# EAGLE design mjGSM (EAGLE 8.4.0)
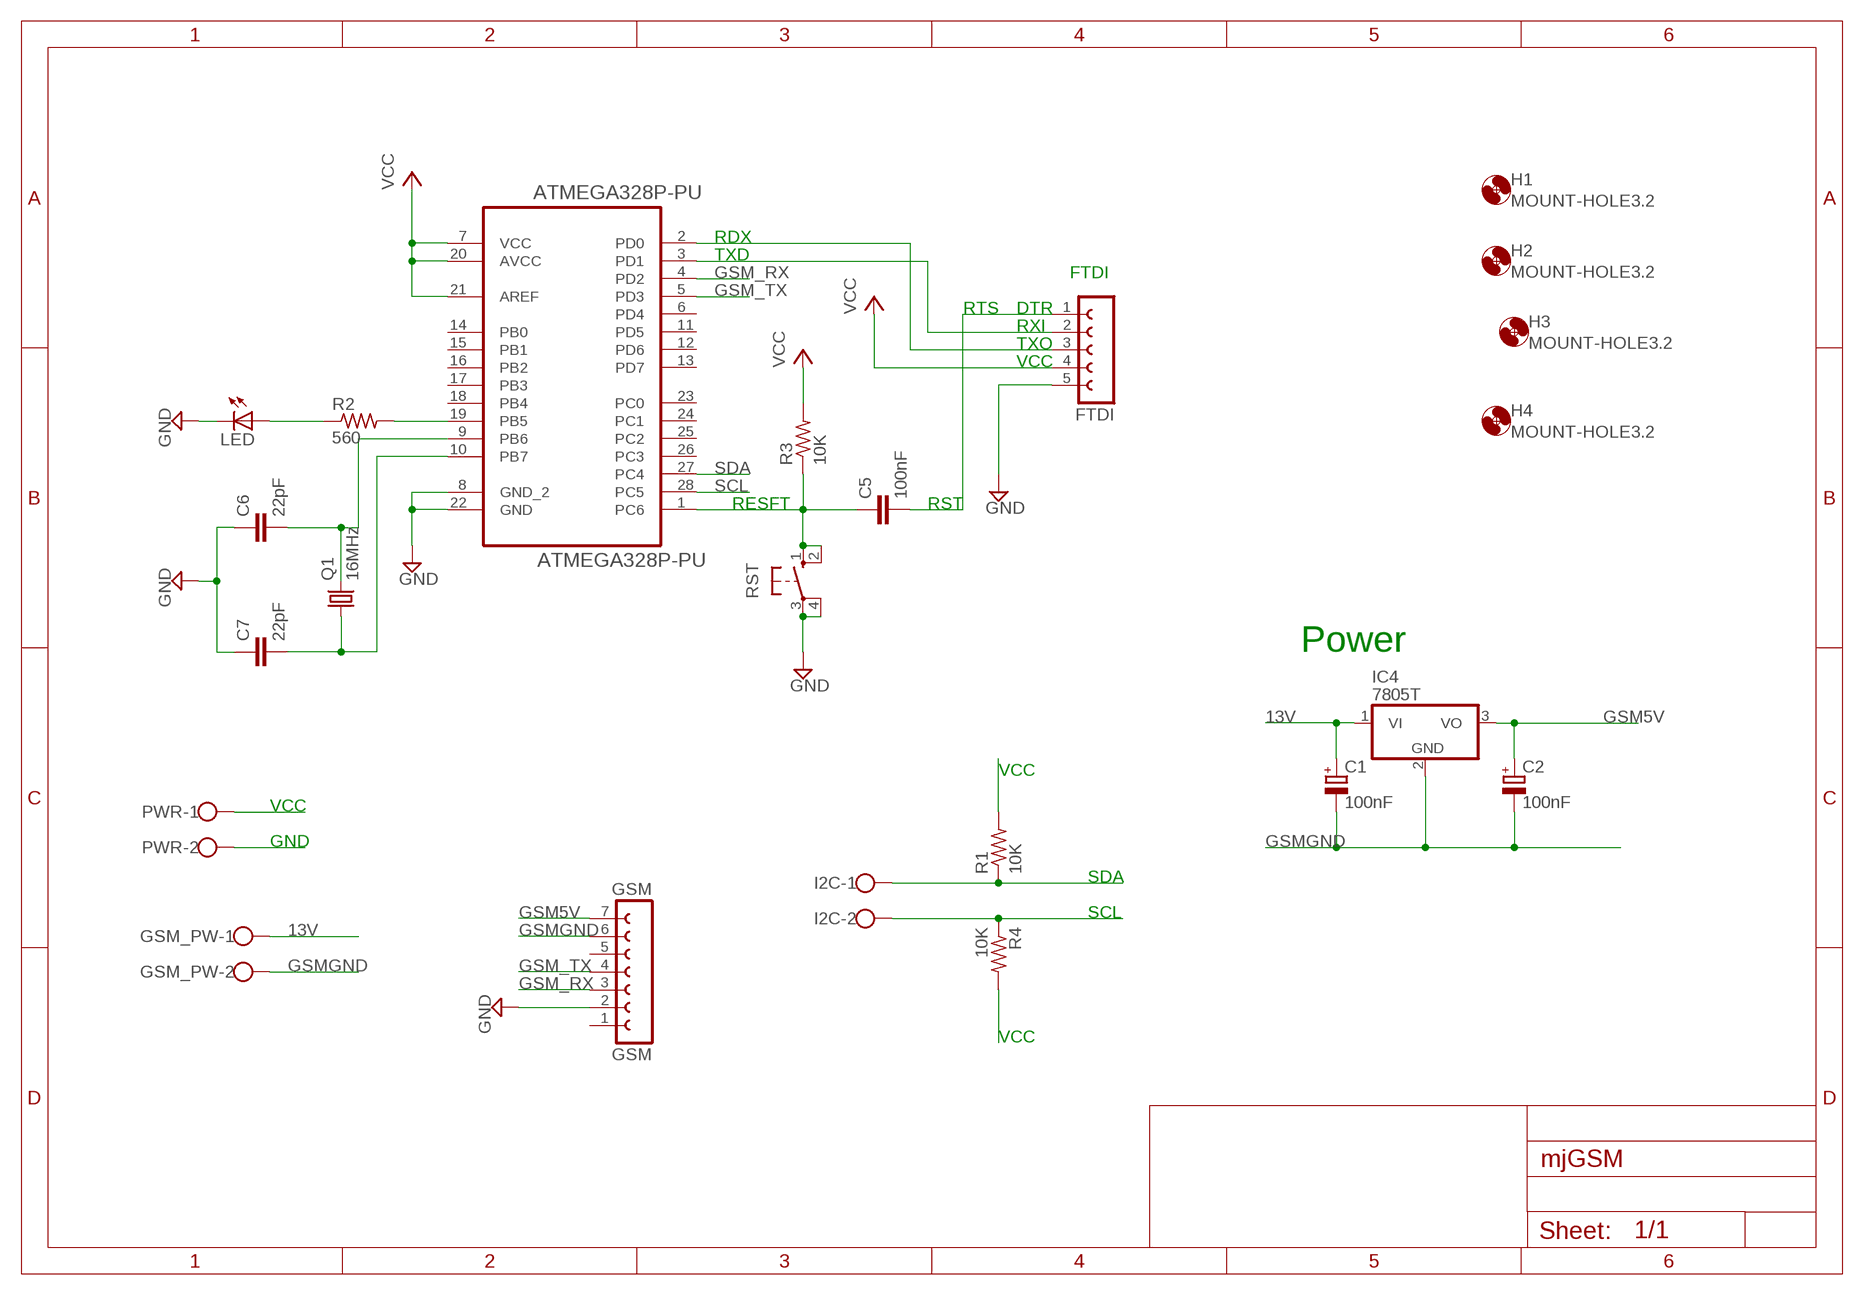
[diagram p0: schematic, sheet 1]

## Parts
ATMEGA328P-PU  ATMEGA328P-PU  [DIP254P762X457-28]
C1  100nF  CPOL-EUE2-4  [E2-4]
C2  100nF  CPOL-EUE2-4  [E2-4]
C5  100nF  C-EU025-024X044  [C025-024X044]
C6  22pF  C-EU025-024X044  [C025-024X044]
C7  22pF  C-EU025-024X044  [C025-024X044]
FTDI  FE05-1  [FE05-1]
GSM  GSM  FE07-1  [FE07]
GSM_PW  W237-102  [W237-102]
H1  MOUNT-HOLE3.2  [3,2]
H2  MOUNT-HOLE3.2  [3,2]
H3  MOUNT-HOLE3.2  [3,2]
H4  MOUNT-HOLE3.2  [3,2]
I2C  W237-102  [W237-102]
IC4  7805T  [TO220H]
LED  LED3MM  [LED3MM]
PWR  W237-102  [W237-102]
Q1  16MHz  CRYSTALHC49S  [HC49/S]
R1  10K  R-US_0204/5  [0204/5]
R2  560  R-US_0204/5  [0204/5]
R3  10K  R-US_0204/5  [0204/5]
R4  10K  R-US_0204/5  [0204/5]
RST  10-XX  [B3F-10XX]

## Nets
13V: C1.+ GSM_PW.1 IC4.1(VI)
GND: ATMEGA328P-PU.8(GND_2) ATMEGA328P-PU.22(GND) C6.1 C7.1 FTDI.5 GSM.2 LED.K(C) PWR.2 RST.3(P) RST.4(P1)
GSM5V: C2.+ GSM.7 IC4.3(VO)
GSM_RX: ATMEGA328P-PU.4(PD2) GSM.3
GSM_TX: ATMEGA328P-PU.5(PD3) GSM.4
GSMGND: C1.- C2.- GSM.6 GSM_PW.2 IC4.2(GND)
N$1: LED.A R2.1
N$2: ATMEGA328P-PU.19(PB5) R2.2
N$3: ATMEGA328P-PU.2(PD0) FTDI.3
N$4: ATMEGA328P-PU.3(PD1) FTDI.2
N$5: ATMEGA328P-PU.1(PC6) C5.1 R3.1 RST.1(S) RST.2(S1)
N$6: ATMEGA328P-PU.9(PB6) C6.2 Q1.2
N$7: C5.2 FTDI.1
N$8: ATMEGA328P-PU.10(PB7) C7.2 Q1.1
SCL: ATMEGA328P-PU.28(PC5) I2C.2 R4.1
SDA: ATMEGA328P-PU.27(PC4) I2C.1 R1.1
VCC: ATMEGA328P-PU.7(VCC) ATMEGA328P-PU.20(AVCC) ATMEGA328P-PU.21(AREF) FTDI.4 PWR.1 R1.2 R3.2 R4.2
Unconnected: ATMEGA328P-PU.6(PD4) ATMEGA328P-PU.11(PD5) ATMEGA328P-PU.12(PD6) ATMEGA328P-PU.13(PD7) ATMEGA328P-PU.14(PB0) ATMEGA328P-PU.15(PB1) ATMEGA328P-PU.16(PB2) ATMEGA328P-PU.17(PB3) ATMEGA328P-PU.18(PB4) ATMEGA328P-PU.23(PC0) ATMEGA328P-PU.24(PC1) ATMEGA328P-PU.25(PC2) ATMEGA328P-PU.26(PC3) GSM.1 GSM.5

## Notes on the sheet
- RDX
- TXD
- FTDI
- RTS | DTR
- RXI
- TXO
- VCC
- RESFT | RST
- Power
- VCC
- VCC
- GND
- SDA
- SCL
- VCC

## Library data of the parts
ATMEGA328P-PU = Atmel_By_element14_Batch_1-00:ATMEGA328P-PU: 8-bit Microcontroller with In-System Programmable Flash; MPN: ATMEGA328P-PU; OC_FARNELL: 1715487; OC_NEWARK: 15R0268; PACKAGE: PDIP-28; SUPPLIER: Atmel
C1 C2 = rcl:CPOL-EU: POLARIZED CAPACITOR, European symbol
C5-C7 = my_rcl:C-EU: CAPACITOR, European symbol
FTDI = con-lsta:FE05-1: FEMALE HEADER; OC_FARNELL: unknown; OC_NEWARK: unknown
GSM = con-lsta:FE07-1: FEMALE HEADER; OC_FARNELL: unknown; OC_NEWARK: unknown
GSM_PW I2C = con-wago-500:W237-102: WAGO SCREW CLAMP; MPN: 237-102; OC_FARNELL: unknown; OC_NEWARK: 70K9898
H1-H4 = holes:MOUNT-HOLE: MOUNTING HOLE with drill center marker
IC4 = linear:78*: Positive VOLTAGE REGULATOR Source: http://cache.national.com/ds/LM/LM78L05.pdf http://www.fairchildsemi.com/ds/LM/LM7805.pdf
LED = led:LED: LED OSRAM: - CHIPLED LG R971, LG N971, LY N971, LG Q971, LY Q971, LO R971, LY R971 LH N974, LH R974 LS Q976, LO Q976, LY Q976 LO Q996 - Hyper CHIPLED LW Q18S LB Q993, LB Q99A, LB R99A - SideLED LS A670, LO A670, LY A670, LG A670, LP A670 LB A673, LV A673, LT A673, LW A673 LH A674 LY A675 LS A676, LA A676, LO A676, LY A676, LW A676 LS A679, LY A679, LG A679 - Hyper Micro SIDELED® LS Y876, LA Y876, LO Y876, LY Y876 LT Y87S - SmartLED LW L88C, LW L88S LB L89C, LB L89S, LG L890 LS L89K, LO L89K, LY L89K LS L896, LA L896, LO L896, LY L896 - TOPLED LS T670, LO T670, LY T670, LG T670, LP T670 LSG T670, LSP T670, LSY T670, LOP T670, LYG T670 LG T671, LOG T671, LSG T671 LB T673, LV T673, LT T673, LW T673 LH T674 LS T676, LA T676, LO T676, LY T676, LB T676, LH T676, LSB T676, LW T676 LB T67C, LV T67C, LT T67C, LS T67K, LO T67K, LY T67K, LW E67C LS E67B, LA E67B, LO E67B, LY E67B, LB E67C, LV E67C, LT E67C LW T67C LS T679, LY T679, LG T679 LS T770, LO T770, LY T770, LG T770, LP T770 LB T773, LV T773, LT T773, LW T773 LH T774 LS E675, LA E675, LY E675, LS T675 LS T776, LA T776, LO T776, LY T776, LB T776 LHGB T686 LT T68C, LB T68C - Hyper Mini TOPLED® LB M676 - Mini TOPLED Santana® LG M470 LS M47K, LO M47K, LY M47K Source: http://www.osram.convergy.de LUXEON: - LUMILED® LXK2-PW12-R00, LXK2-PW12-S00, LXK2-PW14-U00, LXK2-PW14-V00 LXK2-PM12-R00, LXK2-PM12-S00, LXK2-PM14-U00 LXK2-PE12-Q00, LXK2-PE12-R00, LXK2-PE12-S00, LXK2-PE14-T00, LXK2-PE14-U00 LXK2-PB12-K00, LXK2-PB12-L00, LXK2-PB12-M00, LXK2-PB14-N00, LXK2-PB14-P00, LXK2-PB14-Q00 LXK2-PR12-L00, LXK2-PR12-M00, LXK2-PR14-Q00, LXK2-PR14-R00 LXK2-PD12-Q00, LXK2-PD12-R00, LXK2-PD12-S00 LXK2-PH12-R00, LXK2-PH12-S00 LXK2-PL12-P00, LXK2-PL12-Q00, LXK2-PL12-R00 Source: www.luxeon.com KINGBRIGHT: KA-3528ASYC Source: www.kingbright.com
PWR = con-wago-500:W237-102: WAGO SCREW CLAMP; MPN: 237-102; OC_FARNELL: unknown; OC_NEWARK: 70K9898; SPICEPREFIX: X
Q1 = crystal:CRYSTAL: CRYSTAL; OC_FARNELL: 1667008; OC_NEWARK: unknown
R1-R4 = my_rcl:R-US_: RESISTOR, American symbol
RST = switch-omron:10-XX: OMRON SWITCH; MPN: B3F-1000; OC_FARNELL: 176432; OC_NEWARK: 36M3542

## Board
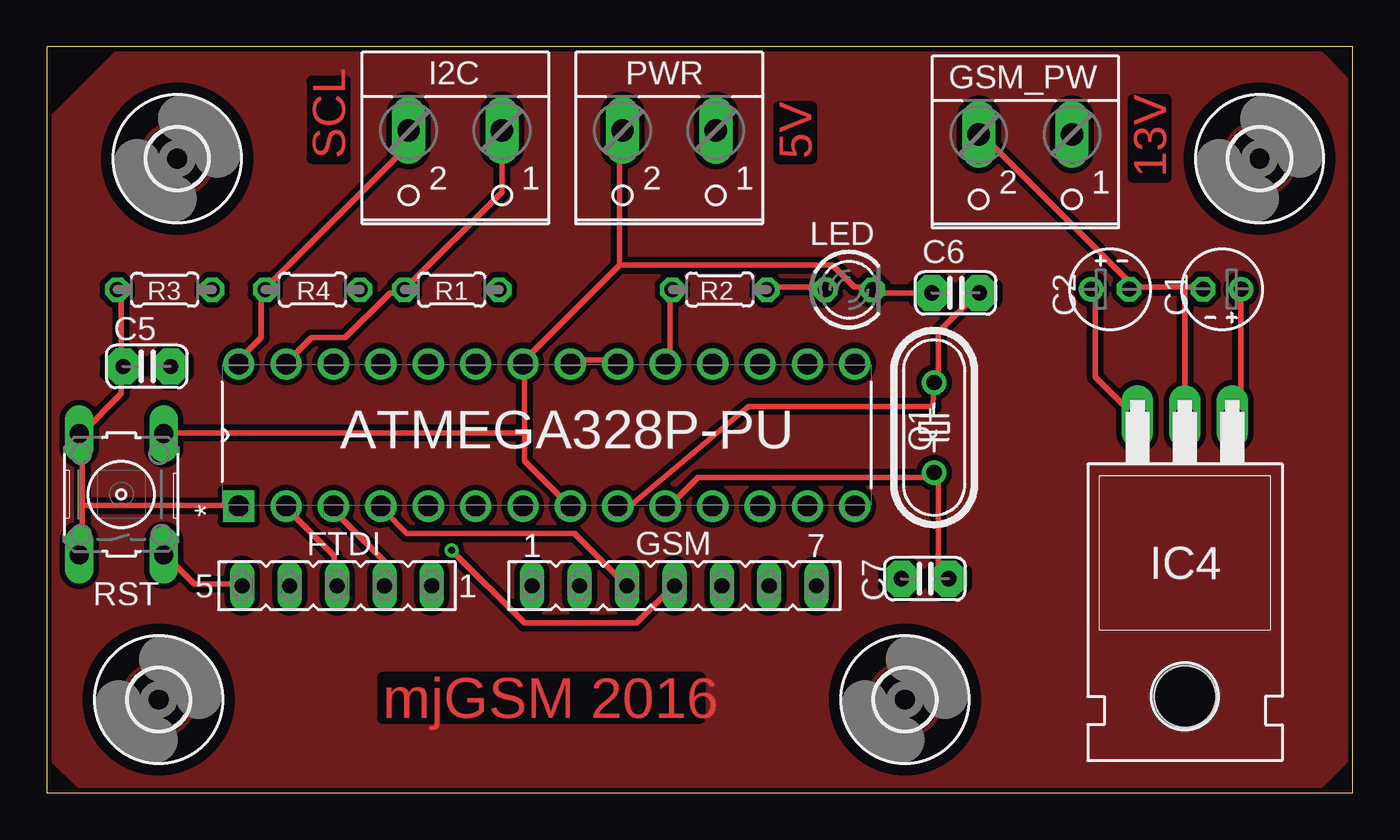
[diagram p1: board, top side]
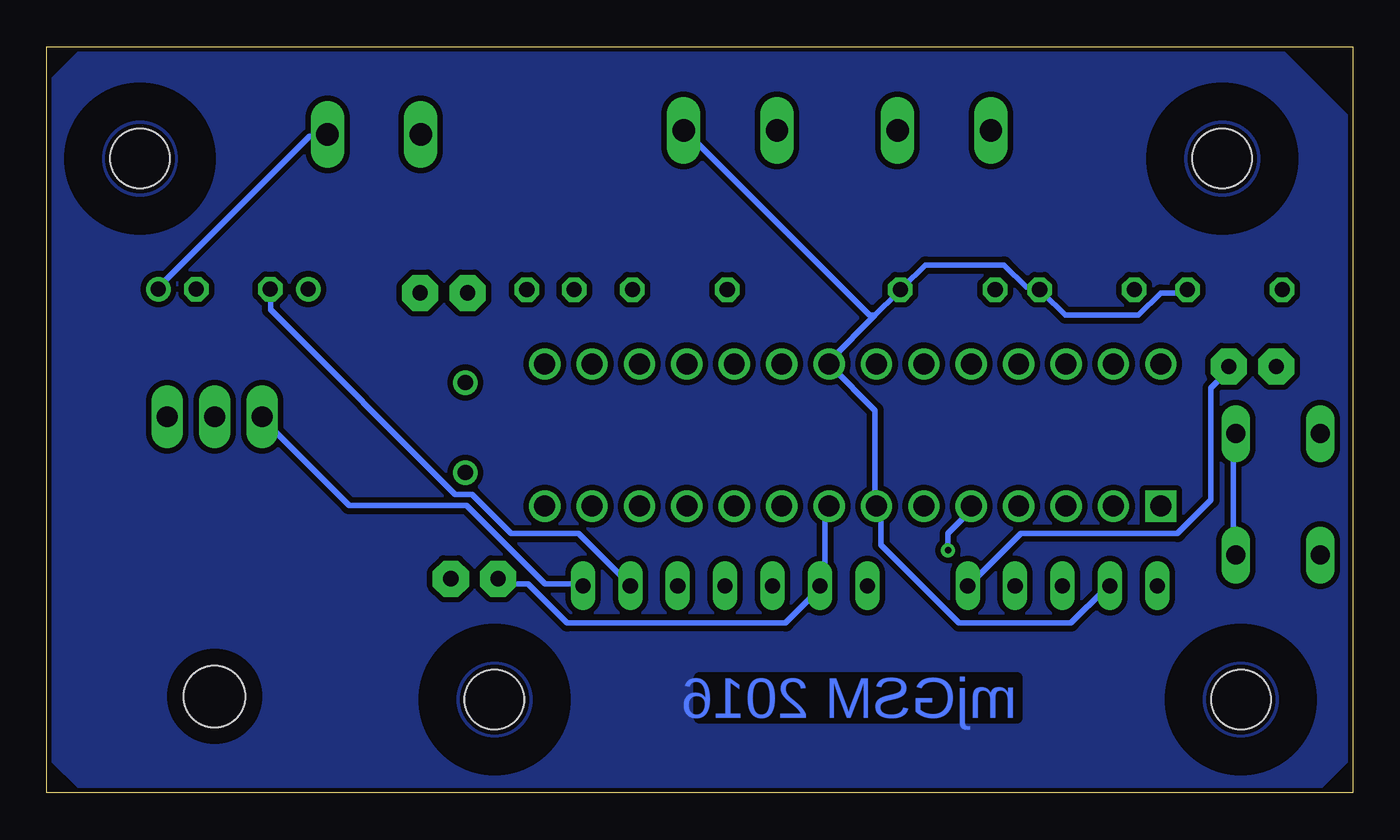
[diagram p2: board, bottom side, seen from below]

Size 70 x 40 mm. Coordinates in mm from the lower left corner, seen from the top.
Outline: 0,0 70,0 70,40 0,40 0,0
Copper layers (1*16): Top 0.105mm / dielectric 1.55mm / Bottom 0.105mm
Design rules "eC_2Layer_PClass3_BaseCopperO105 *": minimum track width 0.3mm, minimum drill 0.35mm, track to track 0.3mm, track to pad 0.3mm, pad to pad 0.3mm, via to via 0.3mm, smd to smd 0mil, copper to edge 0.25mm, drill to drill 0.35mm, minimum pad ring 0.25mm, minimum via ring 0.2mm, stop-mask expansion 0mil, vias tented up to drill 0.45mm, thermal gap 0.2mm

### Footprints (pad centres in the part's own frame; a part is rotated, then mirrored left to right if it is on the bottom)
DIP254P762X457-28 = drill 1.118 square: 1 -7.62,33.02 | drill 1.118: 2 -7.62,30.48; 3 -7.62,27.94; 4 -7.62,25.4; 5 -7.62,22.86; 6 -7.62,20.32; 7 -7.62,17.78; 8 -7.62,15.24; 9 -7.62,12.7; 10 -7.62,10.16; 11 -7.62,7.62; 12 -7.62,5.08; 13 -7.62,2.54; 14 -7.62,0; 15 0,0; 16 0,2.54; 17 0,5.08; 18 0,7.62; 19 0,10.16; 20 0,12.7; 21 0,15.24; 22 0,17.78; 23 0,20.32; 24 0,22.86; 25 0,25.4; 26 0,27.94; 27 0,30.48; 28 0,33.02
E2-4 = drill 0.813 pad 1.27: + -1.016,0 | drill 0.813 pad 1.27 octagon: - 1.016,0
C025-024X044 = drill 0.813 pad 1.93 octagon: 1 -1.27,0; 2 1.27,0
FE05-1 = drill 0.813 long: 1 -5.08,0; 2 -2.54,0; 3 0,0; 4 2.54,0; 5 5.08,0
FE07 = drill 0.813 long: 1 -7.62,0; 2 -5.08,0; 3 -2.54,0; 4 0,0; 5 2.54,0; 6 5.08,0; 7 7.62,0
W237-102 = drill 1.194 long: 1 -2.5,-1.27; 2 2.5,-1.27
3,2 = hole 3.2: 0,0
TO220H = drill 1.118 long: 1 -2.54,-10.16; 2 0,-10.16; 3 2.54,-10.16 | hole 3.302: 0,4.826
LED3MM = drill 0.813 octagon: A -1.27,0; K 1.27,0
HC49/S = drill 0.813: 1 -2.413,0; 2 2.413,0
0204/5 = drill 0.813 octagon: 1 -2.54,0; 2 2.54,0
B3F-10XX = drill 1.016 long: 1 -3.251,2.261; 2 3.251,2.261; 3 -3.251,-2.261; 4 3.251,-2.261

### Placement (x,y rotation side)
ATMEGA328P-PU  43.31,22.99 90 top
C1  63,27 180 top
C2  57,27 0 top
C5  5.37,22.86 0 top
C6  48.71,26.8 0 top
C7  47.07,11.48 0 top
FTDI  15.56,11.1 180 top
GSM  33.64,11.1 0 top
GSM_PW  52.45,34.02 180 top
H1  6,5 0 top
H2  7,34 0 top
H3  46,5 0 top
H4  65,34 0 top
I2C  21.9,34.23 180 top
IC4  61,10 180 top
LED  43,26.98 0 top
PWR  33.36,34.23 180 top
Q1  47.56,19.58 90 top
R1  21.71,26.98 0 top
R2  36.07,26.98 180 top
R3  6.33,26.98 0 top
R4  14.25,26.98 0 top
RST  4,16 90 top

### Tracks (layer width: path | path; a pad name or v marks a point on that pad's centre or on a via)
13V
  Top 0.3: C1.+ 64,26.8 64,20.5 63.7,20.2 IC4.1
  Bottom 0.3: GSM_PW.1 55,35.2 55.9,35.2 64,27.1 C1.+
GND
  Top 0.3: FTDI.5 10.3,11.2 7.9,11.2 6.4,12.7 RST.3 | C6.1 44.5,26.8 LED.K 44.2,27.1 43.3,27.1 42.1,28.3 30.7,28.3 | 25.6,19.3 25.6,17.8 28,15.4 ATMEGA328P-PU.8 | 25.6,19.3 25.6,22.9 ATMEGA328P-PU.22 25.6,23.2 30.7,28.3 | 30.7,28.3 30.7,35.5 PWR.2 | 25.6,19.3 6.4,19.3 RST.4
  Bottom 0.3: RST.4 6.4,19 6.4,13 RST.3 | ATMEGA328P-PU.8 28.3,15.1 28.3,11.2 GSM.2 28.6,10.9 30.4,9.1 42.1,9.1 44.2,11.2 45.7,11.2 C7.1
GSM5V
  Top 0.3: C2.+ 56.2,26.8 56.2,22.3 58.3,20.2 IC4.3
  Bottom 0.3: GSM.7 41.5,11.2 43.3,11.2 47.5,15.4 53.8,15.4 58.3,19.9 IC4.3
GSM_RX
  Top 0.3: GSM.3 28.3,13.9 19.3,13.9 18.1,15.1 ATMEGA328P-PU.4
GSM_TX  (via drill 0.35)
  Top 0.3: v21.7,13 25.6,9.1 31.6,9.1 33.4,10.9 GSM.4
  Bottom 0.3: v21.7,13 21.7,13.9 20.5,15.1 ATMEGA328P-PU.5
GSMGND
  Top 0.3: 58.3,27.1 61,27.1 | 61,27.1 61.9,27.1 C1.- | 61,27.1 IC4.2 | 58.3,27.1 50.2,35.2 GSM_PW.2 | 58.3,27.1 C2.-
  Bottom 0.3: GSM.6 38.8,11.2 41.5,13.9 45.1,13.9 47.2,16 48.1,16 58,25.9 58,26.8 C2.-
N$1
  Top 0.3: R2.1 38.8,27.1 41.5,27.1 LED.A
N$2
  Top 0.3: R2.2 33.4,26.8 33.4,23.2 ATMEGA328P-PU.19
N$3
  Top 0.3: FTDI.3 15.4,11.2 15.4,12.7 13,15.1 ATMEGA328P-PU.2
N$4
  Top 0.3: FTDI.2 18.1,12.4 15.4,15.1 ATMEGA328P-PU.3
N$5
  Top 0.3: R3.1 4,26.8 4,22.9 C5.1 4,22.6 4,21.4 1.9,19.3 RST.2 1.9,19 1.9,15.4 | 1.9,15.4 1.9,13 RST.1 | 1.9,15.4 10,15.4 ATMEGA328P-PU.1
N$6
  Top 0.3: C6.2 49.9,26.8 47.8,24.7 47.8,22 Q1.2 47.5,20.7 37.6,20.7 31.3,15.4 30.7,15.4 ATMEGA328P-PU.9
N$7
  Bottom 0.3: FTDI.1 20.5,11.2 17.8,13.9 9.4,13.9 7.6,15.7 7.6,21.7 6.7,22.6 C5.2
N$8
  Top 0.3: C7.2 48.1,11.5 47.8,11.8 47.8,16.9 Q1.1 47.5,16.9 34.9,16.9 33.4,15.4 ATMEGA328P-PU.10
N$9
  pour Top: 0,36 4,40 68,40 70,38 70,2 68,0 3,0 2,0 0,2
N$10
  pour Bottom: 0,36 4,40 68,40 70,38 70,2 68,0 2,0 0,2
SCL
  Top 0.3: ATMEGA328P-PU.28 10.3,23.2 11.5,24.4 11.5,26.8 R4.1 11.8,27.1 19.3,34.6 19.3,35.5 I2C.2
SDA
  Top 0.3: ATMEGA328P-PU.27 13,23.2 14.2,24.4 16,24.4 18.4,26.8 19,26.8 R1.1 19.3,27.1 24.4,32.2 I2C.1
VCC
  Top 0.3: ATMEGA328P-PU.20 30.4,23.2 28.3,23.2 ATMEGA328P-PU.21
  Bottom 0.3: FTDI.4 13.3,10.9 15.1,9.1 21.1,9.1 25.3,13.3 25.3,15.1 ATMEGA328P-PU.7 25.6,15.4 25.6,20.5 28,22.9 ATMEGA328P-PU.21 28,23.2 25.6,25.6 | R3.2 9.1,26.8 10.3,26.8 11.5,25.6 15.4,25.6 16.6,26.8 R4.2 16.9,27.1 17.5,27.1 18.7,28.3 22.9,28.3 24.1,27.1 R1.2 24.4,26.8 25.6,25.6 | 25.6,25.6 25.9,25.6 35.8,35.5 PWR.1

### Text on the board
Top: SCL | 5V | 13V | mjGSM 2016
Bottom: mjGSM 2016